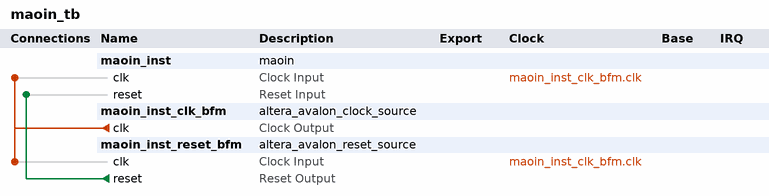
[diagram p0: system contents]
# Platform Designer (Qsys) system maoin_tb, Cyclone 10 LP 10CL080ZU484I8G
# Parameters at their usual value, and those the tool derives, are not listed.
package require -exact qsys 20.1
create_system maoin_tb
set_project_property DEVICE_FAMILY {Cyclone 10 LP}
set_project_property DEVICE 10CL080ZU484I8G

add_instance maoin_inst maoin 1.0

add_instance maoin_inst_clk_bfm altera_avalon_clock_source 20.1

add_instance maoin_inst_reset_bfm altera_avalon_reset_source 20.1
set_instance_parameter_value maoin_inst_reset_bfm ASSERT_HIGH_RESET 0
set_instance_parameter_value maoin_inst_reset_bfm INITIAL_RESET_CYCLES 50

# connections
add_connection maoin_inst_clk_bfm.clk maoin_inst.clk clock
add_connection maoin_inst_clk_bfm.clk maoin_inst_reset_bfm.clk clock
add_connection maoin_inst_reset_bfm.reset maoin_inst.reset reset

set_interconnect_requirement {$system} qsys_mm.clockCrossingAdapter HANDSHAKE
set_interconnect_requirement {$system} qsys_mm.enableEccProtection FALSE
set_interconnect_requirement {$system} qsys_mm.insertDefaultSlave FALSE
set_interconnect_requirement {$system} qsys_mm.maxAdditionalLatency 1

save_system maoin_tb.qsys
